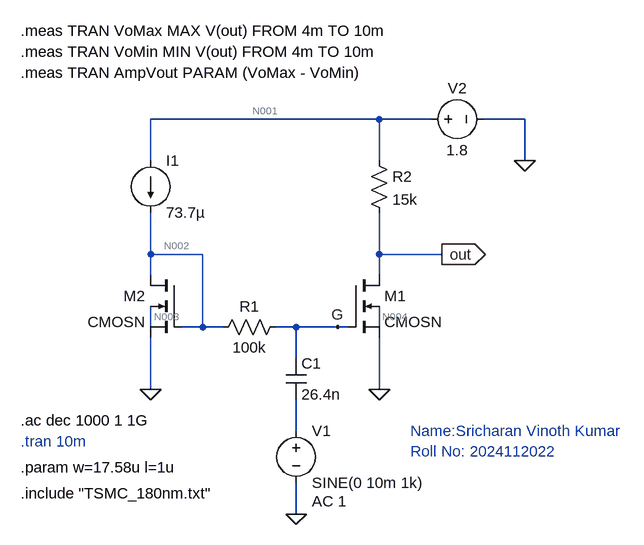
[diagram p0: schematic 4.asc]
4.asc, the LTspice schematic file:
Version 4.1
SHEET 1 880 680
WIRE 320 -96 -32 -96
WIRE 400 -96 320 -96
WIRE 544 -96 480 -96
WIRE -32 -32 -32 -96
WIRE 320 -32 320 -96
WIRE 544 -32 544 -96
WIRE -32 112 -32 48
WIRE 48 112 -32 112
WIRE 320 112 320 48
WIRE 416 112 320 112
WIRE -32 144 -32 112
WIRE 320 144 320 112
WIRE -32 224 -32 192
WIRE 48 224 48 112
WIRE 48 224 16 224
WIRE 80 224 48 224
WIRE 192 224 160 224
WIRE 256 224 192 224
WIRE 272 224 256 224
WIRE 320 224 320 192
WIRE 192 272 192 224
WIRE -32 320 -32 240
WIRE 320 320 320 240
WIRE 192 384 192 336
WIRE 192 512 192 464
FLAG -32 320 0
FLAG 320 320 0
FLAG 192 512 0
FLAG 544 -32 0
FLAG 256 224 G
FLAG 416 112 out
IOPIN 416 112 Out
SYMBOL nmos4 272 144 R0
SYMATTR InstName M1
SYMATTR Value CMOSN
SYMATTR Value2 l=l w=w ad=2.5*l*w as=2.5*l*w pd=5*l+2*w ps=5*l+2*w
SYMBOL nmos4 16 144 M0
SYMATTR InstName M2
SYMATTR Value CMOSN
SYMATTR Value2 l=l w=w ad=2.5*l*w as=2.5*l*w pd=5*l+2*w ps=5*l+2*w
SYMBOL res 176 208 R90
WINDOW 0 0 56 VBottom 2
WINDOW 3 32 56 VTop 2
SYMATTR InstName R1
SYMATTR Value 100k
SYMBOL cap 176 272 R0
SYMATTR InstName C1
SYMATTR Value 26.4n
SYMBOL voltage 192 368 R0
WINDOW 123 24 124 Left 2
WINDOW 39 0 0 Left 0
SYMATTR Value2 AC 1
SYMATTR InstName V1
SYMATTR Value SINE(0 10m 1k)
SYMBOL current -32 -32 R0
WINDOW 123 0 0 Left 0
WINDOW 39 0 0 Left 0
SYMATTR InstName I1
SYMATTR Value 73.7µ
SYMBOL res 304 -48 R0
SYMATTR InstName R2
SYMATTR Value 15k
SYMBOL voltage 384 -96 R270
WINDOW 0 32 56 VTop 2
WINDOW 3 -32 56 VBottom 2
WINDOW 123 0 0 Left 0
WINDOW 39 0 0 Left 0
SYMATTR InstName V2
SYMATTR Value 1.8
TEXT -232 440 Left 2 !.param w=17.58u l=1u
TEXT -232 480 Left 2 !.include "TSMC_180nm.txt"
TEXT -232 400 Left 2 ;.tran 10m
TEXT 368 384 Left 2 ;Name:Sricharan Vinoth Kumar\nRoll No: 2024112022
TEXT -232 -232 Left 2 !.meas TRAN VoMax MAX V(out) FROM 4m TO 10m
TEXT -232 -200 Left 2 !.meas TRAN VoMin MIN V(out) FROM 4m TO 10m
TEXT -232 -168 Left 2 !.meas TRAN AmpVout PARAM (VoMax - VoMin)
TEXT -232 368 Left 2 !.ac dec 1000 1 1G

The netlist it stands for:
* 4.asc
M1 out G 0 N004 CMOSN l=l w=w ad=2.5*l*w as=2.5*l*w pd=5*l+2*w ps=5*l+2*w
M2 N002 N002 0 N003 CMOSN l=l w=w ad=2.5*l*w as=2.5*l*w pd=5*l+2*w ps=5*l+2*w
R1 G N002 100k
C1 G N005 26.4n
V1 N005 0 SINE(0 10m 1k) AC 1
I1 N001 N002 73.7µ
R2 N001 out 15k
V2 N001 0 1.8
.model NMOS NMOS
.model PMOS PMOS
.lib standard.mos
.param w=17.58u l=1u
.include "TSMC_180nm.txt"
* .tran 10m
* Name:Sricharan Vinoth Kumar
* Roll No: 2024112022
.meas TRAN VoMax MAX V(out) FROM 4m TO 10m
.meas TRAN VoMin MIN V(out) FROM 4m TO 10m
.meas TRAN AmpVout PARAM (VoMax - VoMin)
.ac dec 1000 1 1G
.backanno
.end

* Results of the author's LTspice run, read from the files saved beside the schematic
* Operating Point, zero values left out:
*   V(g) = 591.8 mV
*   V(n002) = 591.8 mV
*   V(n003) = 107.3 mV
*   V(n001) = 1.8 V
*   V(out) = 671.3 mV
*   V(n004) = 112.6 mV
*   Id(M1) = 75.24 µA
*   Is(M1) = -75.24 µA
*   I(I1) = 73.7 µA
*   I(V2) = -148.9 µA
*   I(R2) = 75.24 µA
*   Id(M2) = 73.7 µA
*   Is(M2) = -73.7 µA
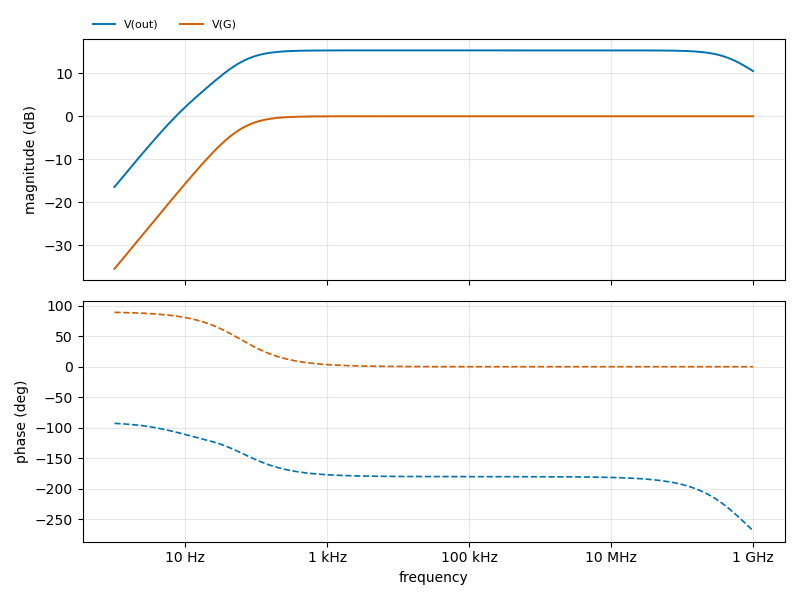
[diagram p1: AC Analysis of 4.asc, plotted from the saved traces]
* AC Analysis, 1 run:
*   V(out): -16.45 dB at 1 Hz, 10.50 dB at 1 GHz, peak 15.33 dB at 188.8 kHz, 3 dB below the peak at 56.72 Hz and 651.4 MHz
*   V(G): -35.50 dB at 1 Hz, -0.00 dB at 1 GHz, peak -0.00 dB at 1 GHz, 3 dB below the peak at 59.61 Hz